# EAGLE design atsams70n-switch (EAGLE 8.3.2)
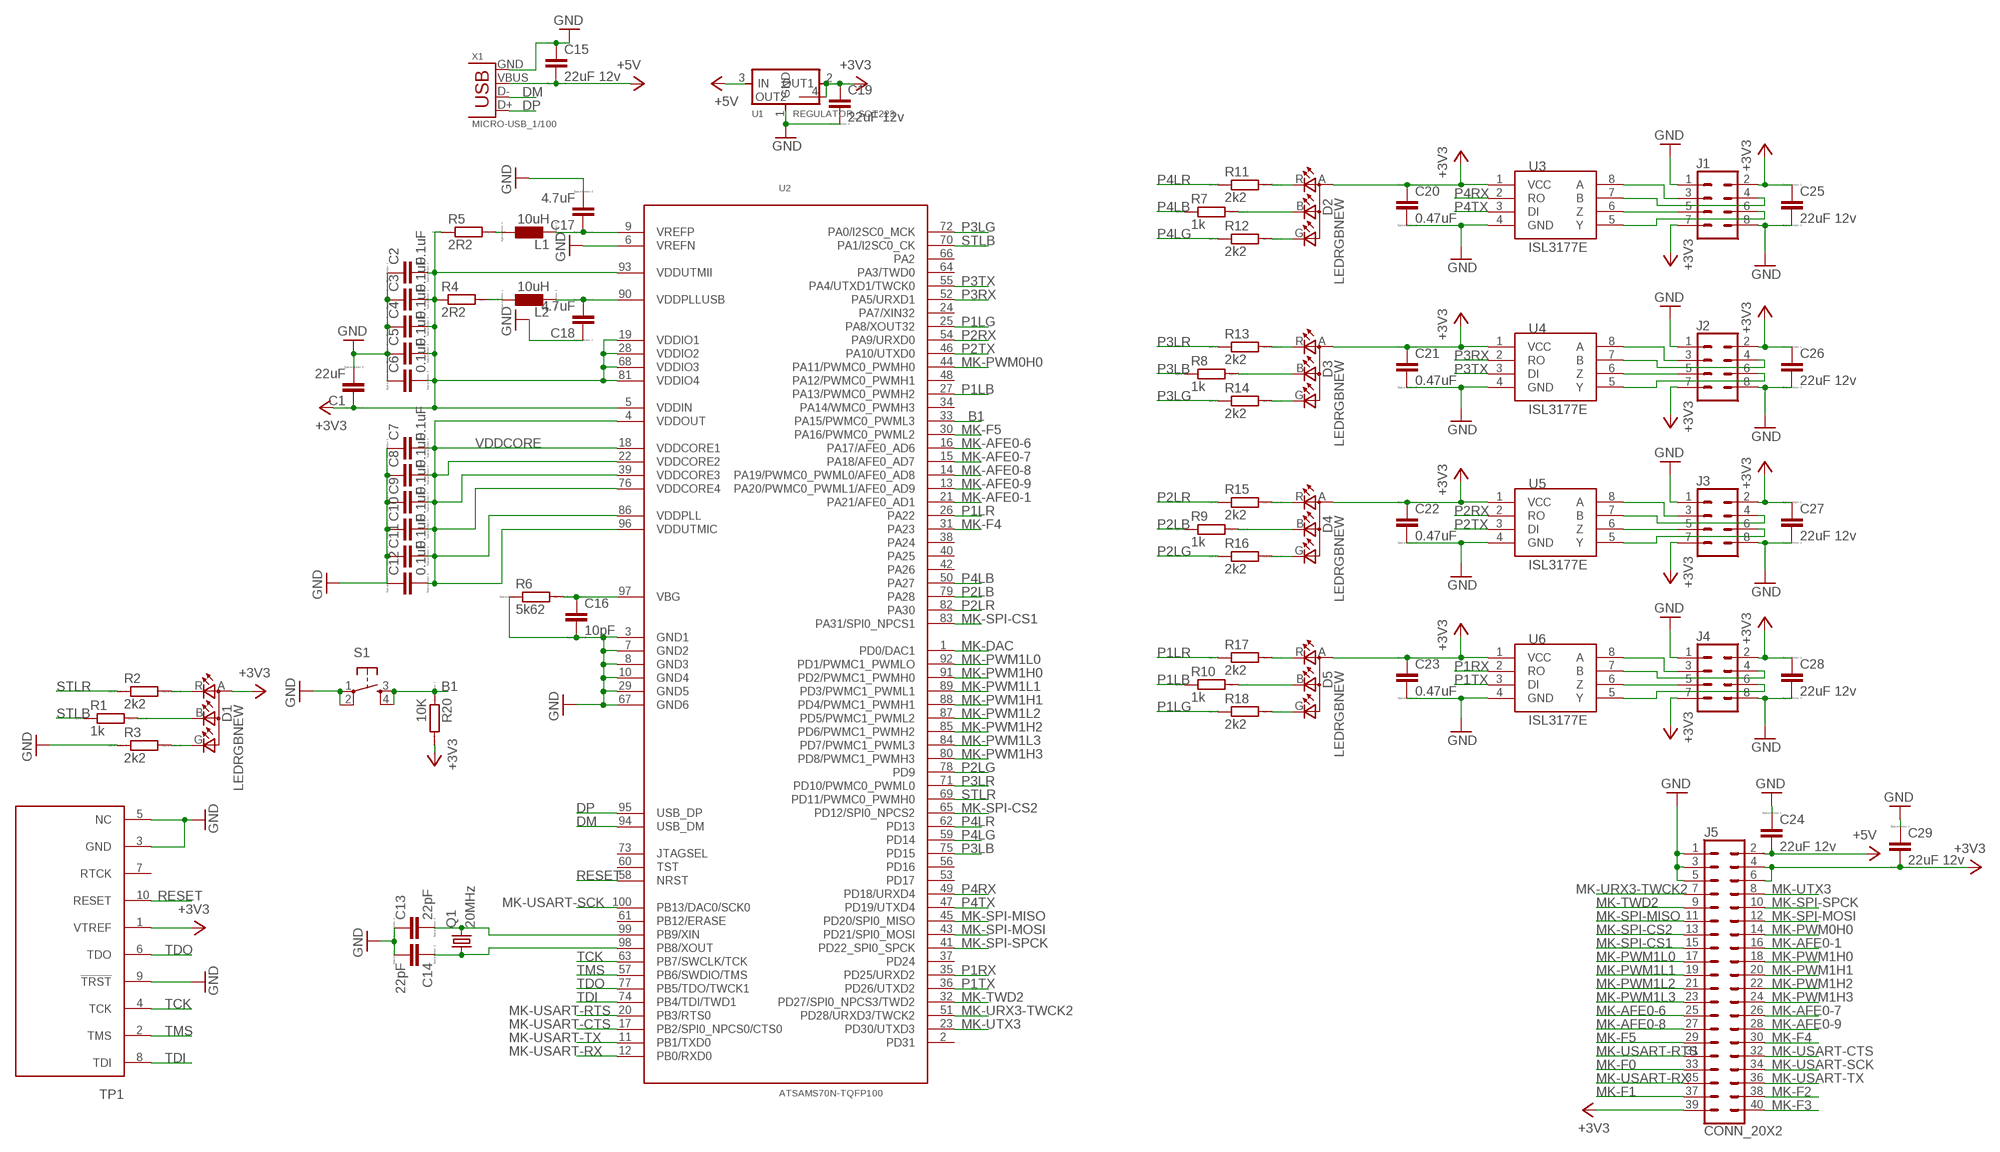
[diagram p0: schematic, sheet 1]

## Parts
C1  22uF  C  [C0805]
C2  0.1uF  CC0603  [C0603]
C3  0.1uF  CC0603  [C0603]
C4  0.1uF  CC0603  [C0603]
C5  0.1uF  CC0603  [C0603]
C6  0.1uF  CC0603  [C0603]
C7  0.1uF  CC0603  [C0603]
C8  0.1uF  CC0603  [C0603]
C9  0.1uF  CC0603  [C0603]
C10  0.1uF  CC0603  [C0603]
C11  0.1uF  CC0603  [C0603]
C12  0.1uF  CC0603  [C0603]
C13  22pF  CC0603  [C0603]
C14  22pF  CC0603  [C0603]
C15  22uF 12v  C  [C0805]
C16  10pF  C  [C0805]
C17  4.7uF  C  [C0805]
C18  4.7uF  C  [C0805]
C19  22uF 12v  C  [C0805]
C20  0.47uF  C  [C0805]
C21  0.47uF  C  [C0805]
C22  0.47uF  C  [C0805]
C23  0.47uF  C  [C0805]
C24  22uF 12v  C  [C0805]
C25  22uF 12v  C  [C0805]
C26  22uF 12v  C  [C0805]
C27  22uF 12v  C  [C0805]
C28  22uF 12v  C  [C0805]
C29  22uF 12v  C  [C0805]
D1  LEDRGBNEW  [P-LCC-4]
D2  LEDRGBNEW  [P-LCC-4]
D3  LEDRGBNEW  [P-LCC-4]
D4  LEDRGBNEW  [P-LCC-4]
D5  LEDRGBNEW  [P-LCC-4]
J1  CONN_04X2SHROUDED  [2X4-SHROUDED]
J2  CONN_04X2SHROUDED  [2X4-SHROUDED]
J3  CONN_04X2SHROUDED  [2X4-SHROUDED]
J4  CONN_04X2SHROUDED  [2X4-SHROUDED]
J5  CONN_20X2  [2X20]
L1  10uH  L  [L1812]
L2  10uH  L  [L1812]
Q1  20MHz  CRYSTALCTS406  [CTS406]
R1  1k  R  [R0805]
R2  2k2  R  [R0805]
R3  2k2  R  [R0805]
R4  2R2  R  [R0805]
R5  2R2  R  [R0805]
R6  5k62  R  [R0805]
R7  1k  R  [R0805]
R8  1k  R  [R0805]
R9  1k  R  [R0805]
R10  1k  R  [R0805]
R11  2k2  R  [R0805]
R12  2k2  R  [R0805]
R13  2k2  R  [R0805]
R14  2k2  R  [R0805]
R15  2k2  R  [R0805]
R16  2k2  R  [R0805]
R17  2k2  R  [R0805]
R18  2k2  R  [R0805]
R20  10K  R  [R0805]
S1  6MM_SWITCH6MM_SWITCH  [6MM_SWITCH]
TP1  TC2050-MCP-NL  [TC2030-MCP-NL]
U1  REGULATOR_SOT223  [SOT223]
U2  ATSAMS70N-TQFP100  [TQFP100-14X14]
U3  ISL3177E  [MSOP8]
U4  ISL3177E  [MSOP8]
U5  ISL3177E  [MSOP8]
U6  ISL3177E  [MSOP8]
X1  MICRO-USB_1/100  [DX4R005HJ5_100]

## Nets
+3V3: C1.1 C2.2 C3.2 C4.2 C5.2 C6.2 C19.1 C20.1 C21.1 C22.1 C23.1 C25.1 C26.1 C27.1 C28.1 C29.2 D1.A(A2) D2.A(A2) D3.A(A2) D4.A(A2) D5.A(A2) J1.2 J1.7 J2.2 J2.7 J3.2 J3.7 J4.2 J4.7 J5.4 J5.6 J5.39 R4.1 R5.1 R20.2 TP1.1(VTREF) U1.2(OUT1) U1.4(OUT2) U2.5(VDDIN) U2.19(VDDIO1) U2.28(VDDIO2) U2.68(VDDIO3) U2.81(VDDIO4) U2.93(VDDUTMII) U3.1(VCC) U4.1(VCC) U5.1(VCC) U6.1(VCC)
+5V: C15.2 C24.2 J5.2 U1.3(IN) X1.VBUS
B1: R20.1 S1.3(S) S1.4(S1) U2.33(PA15/PWMC0_PWML3)
DM: U2.94(USB_DM) X1.D-
DP: U2.95(USB_DP) X1.D+
GND: C1.2 C2.1 C3.1 C4.1 C5.1 C6.1 C7.1 C8.1 C9.1 C10.1 C11.1 C12.1 C13.1 C14.2 C15.1 C16.2 C17.2 C18.1 C19.2 C20.2 C21.2 C22.2 C23.2 C24.1 C25.2 C26.2 C27.2 C28.2 C29.1 J1.1 J1.8 J2.1 J2.8 J3.1 J3.8 J4.1 J4.8 J5.1 J5.3 J5.5 R3.1 R6.1 S1.1(P) S1.2(P1) TP1.3(GND) TP1.5(NC) TP1.9(!TRST) U1.1(GND) U2.3(GND1) U2.6(VREFN) U2.7(GND2) U2.8(GND3) U2.10(GND4) U2.29(GND5) U2.67(GND6) U3.4(GND) U4.4(GND) U5.4(GND) U6.4(GND) X1.GND
MK-AFE0-1: J5.16 U2.21(PA21/AFE0_AD1)
MK-AFE0-6: J5.25 U2.16(PA17/AFE0_AD6)
MK-AFE0-7: J5.26 U2.15(PA18/AFE0_AD7)
MK-AFE0-8: J5.27 U2.14(PA19/PWMC0_PWML0/AFE0_AD8)
MK-AFE0-9: J5.28 U2.13(PA20/PWMC0_PWML1/AFE0_AD9)
MK-DAC: U2.1(PD0/DAC1)
MK-F0: J5.33
MK-F1: J5.37
MK-F2: J5.38
MK-F3: J5.40
MK-F4: J5.30 U2.31(PA23)
MK-F5: J5.29 U2.30(PA16/PWMC0_PWML2)
MK-PWM0H0: J5.14 U2.44(PA11/PWMC0_PWMH0)
MK-PWM1H0: J5.18 U2.91(PD2/PWMC1_PWMH0)
MK-PWM1H1: J5.20 U2.88(PD4/PWMC1_PWMH1)
MK-PWM1H2: J5.22 U2.85(PD6/PWMC1_PWMH2)
MK-PWM1H3: J5.24 U2.80(PD8/PWMC1_PWMH3)
MK-PWM1L0: J5.17 U2.92(PD1/PWMC1_PWMLO)
MK-PWM1L1: J5.19 U2.89(PD3/PWMC1_PWML1)
MK-PWM1L2: J5.21 U2.87(PD5/PWMC1_PWML2)
MK-PWM1L3: J5.23 U2.84(PD7/PWMC1_PWML3)
MK-SPI-CS1: J5.15 U2.83(PA31/SPI0_NPCS1)
MK-SPI-CS2: J5.13 U2.65(PD12/SPI0_NPCS2)
MK-SPI-MISO: J5.11 U2.45(PD20/SPI0_MISO)
MK-SPI-MOSI: J5.12 U2.43(PD21/SPI0_MOSI)
MK-SPI-SPCK: J5.10 U2.41(PD22_SPI0_SPCK)
MK-TWD2: J5.9 U2.32(PD27/SPI0_NPCS3/TWD2)
MK-URX3-TWCK2: J5.7 U2.51(PD28/URXD3/TWCK2)
MK-USART-CTS: J5.32 U2.17(PB2/SPI0_NPCS0/CTS0)
MK-USART-RTS: J5.31 U2.20(PB3/RTS0)
MK-USART-RX: J5.35 U2.12(PB0/RXD0)
MK-USART-SCK: J5.34 U2.100(PB13/DAC0/SCK0)
MK-USART-TX: J5.36 U2.11(PB1/TXD0)
MK-UTX3: J5.8 U2.23(PD30/UTXD3)
N$1: D5.R(CRED) R17.2
N$2: D5.B(CBLUE) R10.2
N$3: D5.G(CGREEN) R18.2
N$4: C13.2 Q1.3 U2.99(PB9/XIN)
N$5: C14.1 Q1.1 U2.98(PB8/XOUT)
N$7: C16.1 R6.2 U2.97(VBG)
N$8: L2.1 R4.2
N$9: L1.1 R5.2
N$10: C18.2 L2.2 U2.90(VDDPLLUSB)
N$11: C17.1 L1.2 U2.9(VREFP)
N$12: D1.R(CRED) R2.2
N$13: J3.3 U5.8(A)
N$14: J3.4 U5.7(B)
N$15: J3.5 U5.6(Z)
N$16: J3.6 U5.5(Y)
N$17: D4.R(CRED) R15.2
N$18: D4.B(CBLUE) R9.2
N$19: D4.G(CGREEN) R16.2
N$20: J2.3 U4.8(A)
N$21: J2.4 U4.7(B)
N$22: J2.5 U4.6(Z)
N$23: J2.6 U4.5(Y)
N$24: D3.R(CRED) R13.2
N$25: J4.3 U6.8(A)
N$26: J4.4 U6.7(B)
N$27: J4.5 U6.6(Z)
N$28: J4.6 U6.5(Y)
N$29: D3.B(CBLUE) R8.2
N$30: D3.G(CGREEN) R14.2
N$31: J1.3 U3.8(A)
N$32: J1.4 U3.7(B)
N$33: J1.5 U3.6(Z)
N$34: J1.6 U3.5(Y)
N$35: D2.R(CRED) R11.2
N$36: D2.B(CBLUE) R7.2
N$37: D2.G(CGREEN) R12.2
N$38: D1.B(CBLUE) R1.2
N$39: D1.G(CGREEN) R3.2
P1LB: R10.1 U2.27(PA13/PWMC0_PWMH2)
P1LG: R18.1 U2.25(PA8/XOUT32)
P1LR: R17.1 U2.26(PA22)
P1RX: U2.35(PD25/URXD2) U6.2(RO)
P1TX: U2.36(PD26/UTXD2) U6.3(DI)
P2LB: R9.1 U2.79(PA28)
P2LG: R16.1 U2.78(PD9)
P2LR: R15.1 U2.82(PA30)
P2RX: U2.54(PA9/URXD0) U5.2(RO)
P2TX: U2.46(PA10/UTXD0) U5.3(DI)
P3LB: R8.1 U2.75(PD15)
P3LG: R14.1 U2.72(PA0/I2SC0_MCK)
P3LR: R13.1 U2.71(PD10/PWMC0_PWML0)
P3RX: U2.52(PA5/URXD1) U4.2(RO)
P3TX: U2.55(PA4/UTXD1/TWCK0) U4.3(DI)
P4LB: R7.1 U2.50(PA27)
P4LG: R12.1 U2.59(PD14)
P4LR: R11.1 U2.62(PD13)
P4RX: U2.49(PD18/URXD4) U3.2(RO)
P4TX: U2.47(PD19/UTXD4) U3.3(DI)
RESET: TP1.10(RESET) U2.58(NRST)
STLB: R1.1 U2.70(PA1/I2SC0_CK)
STLR: R2.1 U2.69(PD11/PWMC0_PWMH0)
TCK: TP1.4(TCK) U2.63(PB7/SWCLK/TCK)
TDI: TP1.8(TDI) U2.74(PB4/TDI/TWD1)
TDO: TP1.6(TDO) U2.77(PB5/TDO/TWCK1)
TMS: TP1.2(TMS) U2.57(PB6/SWDIO/TMS)
VDDCORE: C7.2 C8.2 C9.2 C10.2 C11.2 C12.2 U2.4(VDDOUT) U2.18(VDDCORE1) U2.22(VDDCORE2) U2.39(VDDCORE3) U2.76(VDDCORE4) U2.86(VDDPLL) U2.96(VDDUTMIC)
Unconnected: TP1.7(RTCK) U2.2(PD31) U2.24(PA7/XIN32) U2.34(PA14/WMC0_PWMH3) U2.37(PD24) U2.38(PA24) U2.40(PA25) U2.42(PA26) U2.48(PA12/PWMC0_PWMH1) U2.53(PD17) U2.56(PD16) U2.60(TST) U2.61(PB12/ERASE) U2.64(PA3/TWD0) U2.66(PA2) U2.73(JTAGSEL)

## Library data of the parts
C1-C29 = eagle-ltspice:C: CAPACITOR, European symbol; SPICEMODEL: NONE; SPICEPREFIX: C
D1-D5 = fab:LEDRGBNEW
J1-J4 = fab:CONN_04X2: Multi connection point. Often used as Generic Header-pin footprint for 0.1 inch spaced/style header connections On any of the 0.1 inch spaced packages, you can populate with these: Break Away Headers - Straight <https://www.sparkfun.com/products/116> (PRT-00116) Break Away Male Headers - Right Angle <https://www.sparkfun.com/products/553> (PRT-00553) Female Headers <https://www.sparkfun.com/products/115> (PRT-00115) Break Away Headers - Machine Pin <https://www.sparkfun.com/products/117> (PRT-00117) Break Away Female Headers - Swiss Machine Pin <https://www.sparkfun.com/products/743> (PRT-00743)
J5 = SparkFun-Connectors:CONN_20X2: Multi connection point. Often used as Generic Header-pin footprint for 0.1 inch spaced/style header connections On any of the 0.1 inch spaced packages, you can populate with these: Break Away Headers - Straight <https://www.sparkfun.com/products/116> (PRT-00116) Break Away Male Headers - Right Angle <https://www.sparkfun.com/products/553> (PRT-00553) Female Headers <https://www.sparkfun.com/products/115> (PRT-00115) Break Away Headers - Machine Pin <https://www.sparkfun.com/products/117> (PRT-00117) Break Away Female Headers - Swiss Machine Pin <https://www.sparkfun.com/products/743> (PRT-00743)
L1 L2 = eagle-ltspice:L: INDUCTOR, European symbol; SPICEMODEL: NONE; SPICEPREFIX: L
Q1 = crystal:CRYSTAL: CRYSTAL; OC_FARNELL: unknown; OC_NEWARK: unknown
R1-R18 R20 = eagle-ltspice:R: RESISTOR, European symbol; SPICEMODEL: NONE; SPICEPREFIX: R
S1 = fab:6MM_SWITCH: OMRON SWITCH
TP1 = tag-connect-2050:TC2050: TAG-CONNECT ISP Connector Manufacturer: Tag-Connect <www.tag-connect.com> Cable for easy In-Circuit PCB Programming. Designed for JTAG 10 pin, suitable for many others. Pin Connection for TC2050 NL. PAD Description 1 VTREF 2 TMS 3 GND 4 TCK 5 NC 6 TDO 7 RTCK 8 TDI 9 !TRST 10 RESET ©2009 ROFA.cz Modified 7/2011 by Tim McCarthy-Smith VIDA Products INC
U1 = fab:REGULATOR_SOT223
U2 = fab:ATSAMS70N-TQFP100
U3-U6 = fab:ISL3177E
X1 = fab:MICRO-USB: SMD micro USB connector as found in the fablab inventory. Three footprint variants included: original, as described by manufacturer's datasheet for milling with the 1/100" bit for milling with the 1/64" bit Made by Zaerc.

## Board
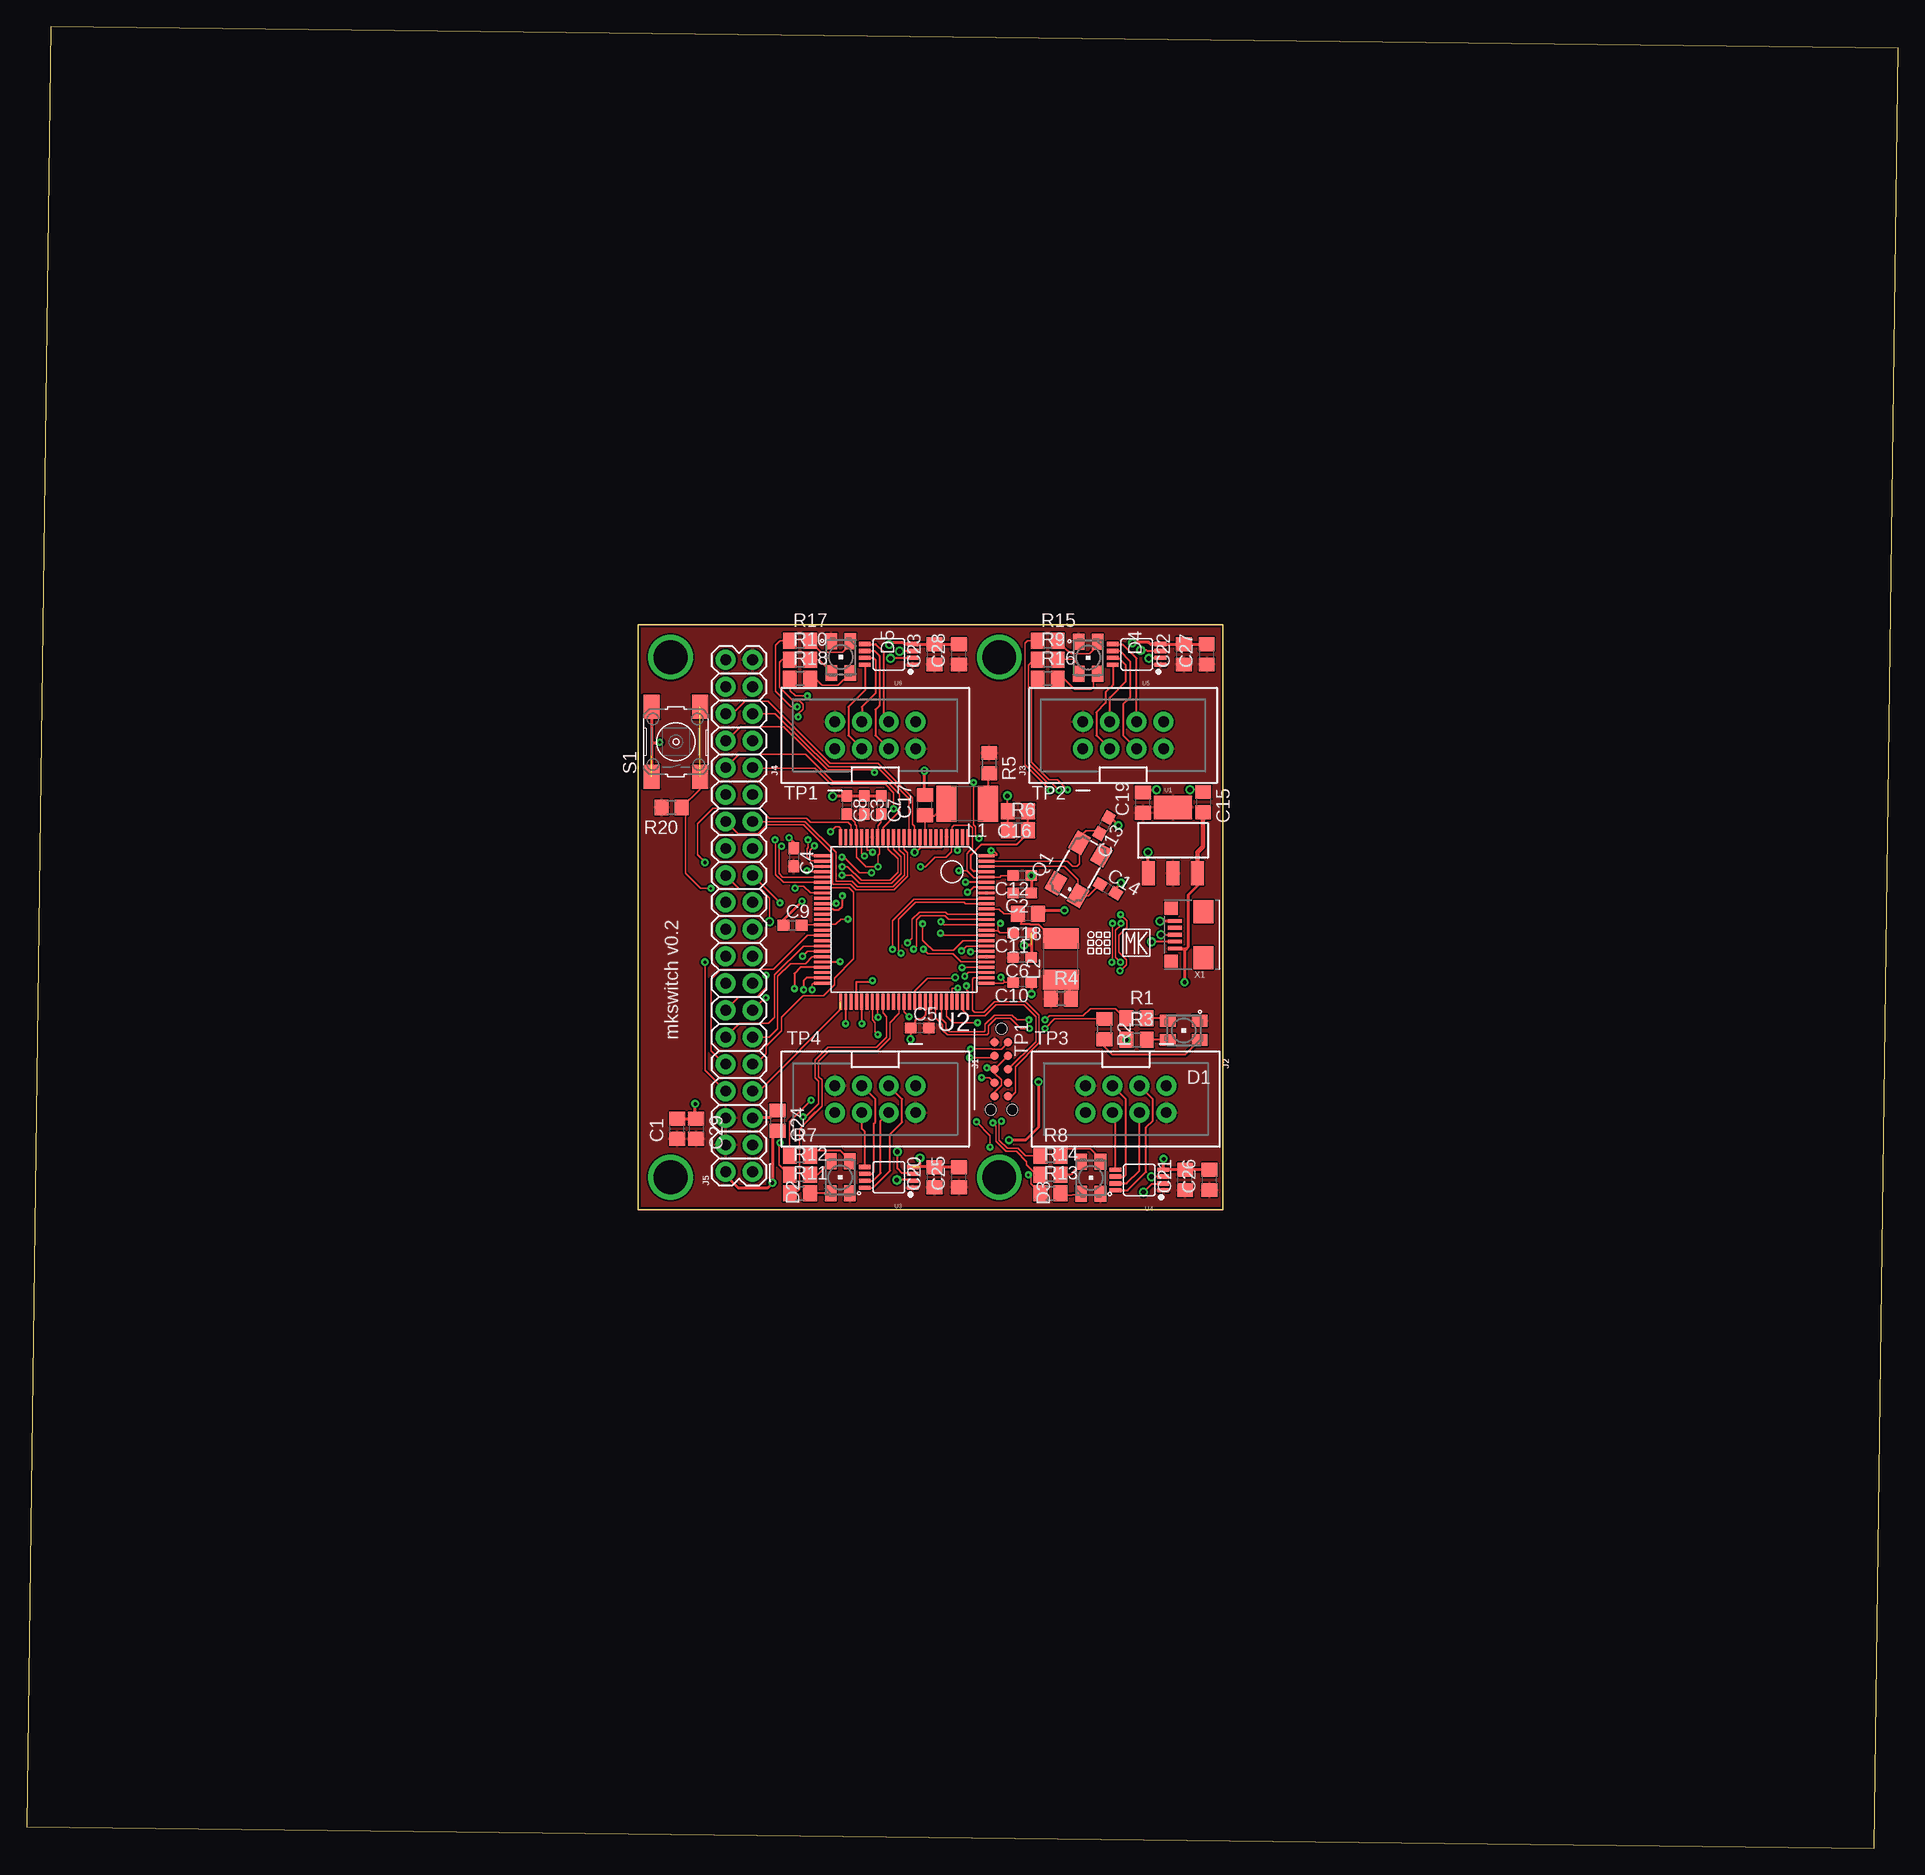
[diagram p1: board, top side]
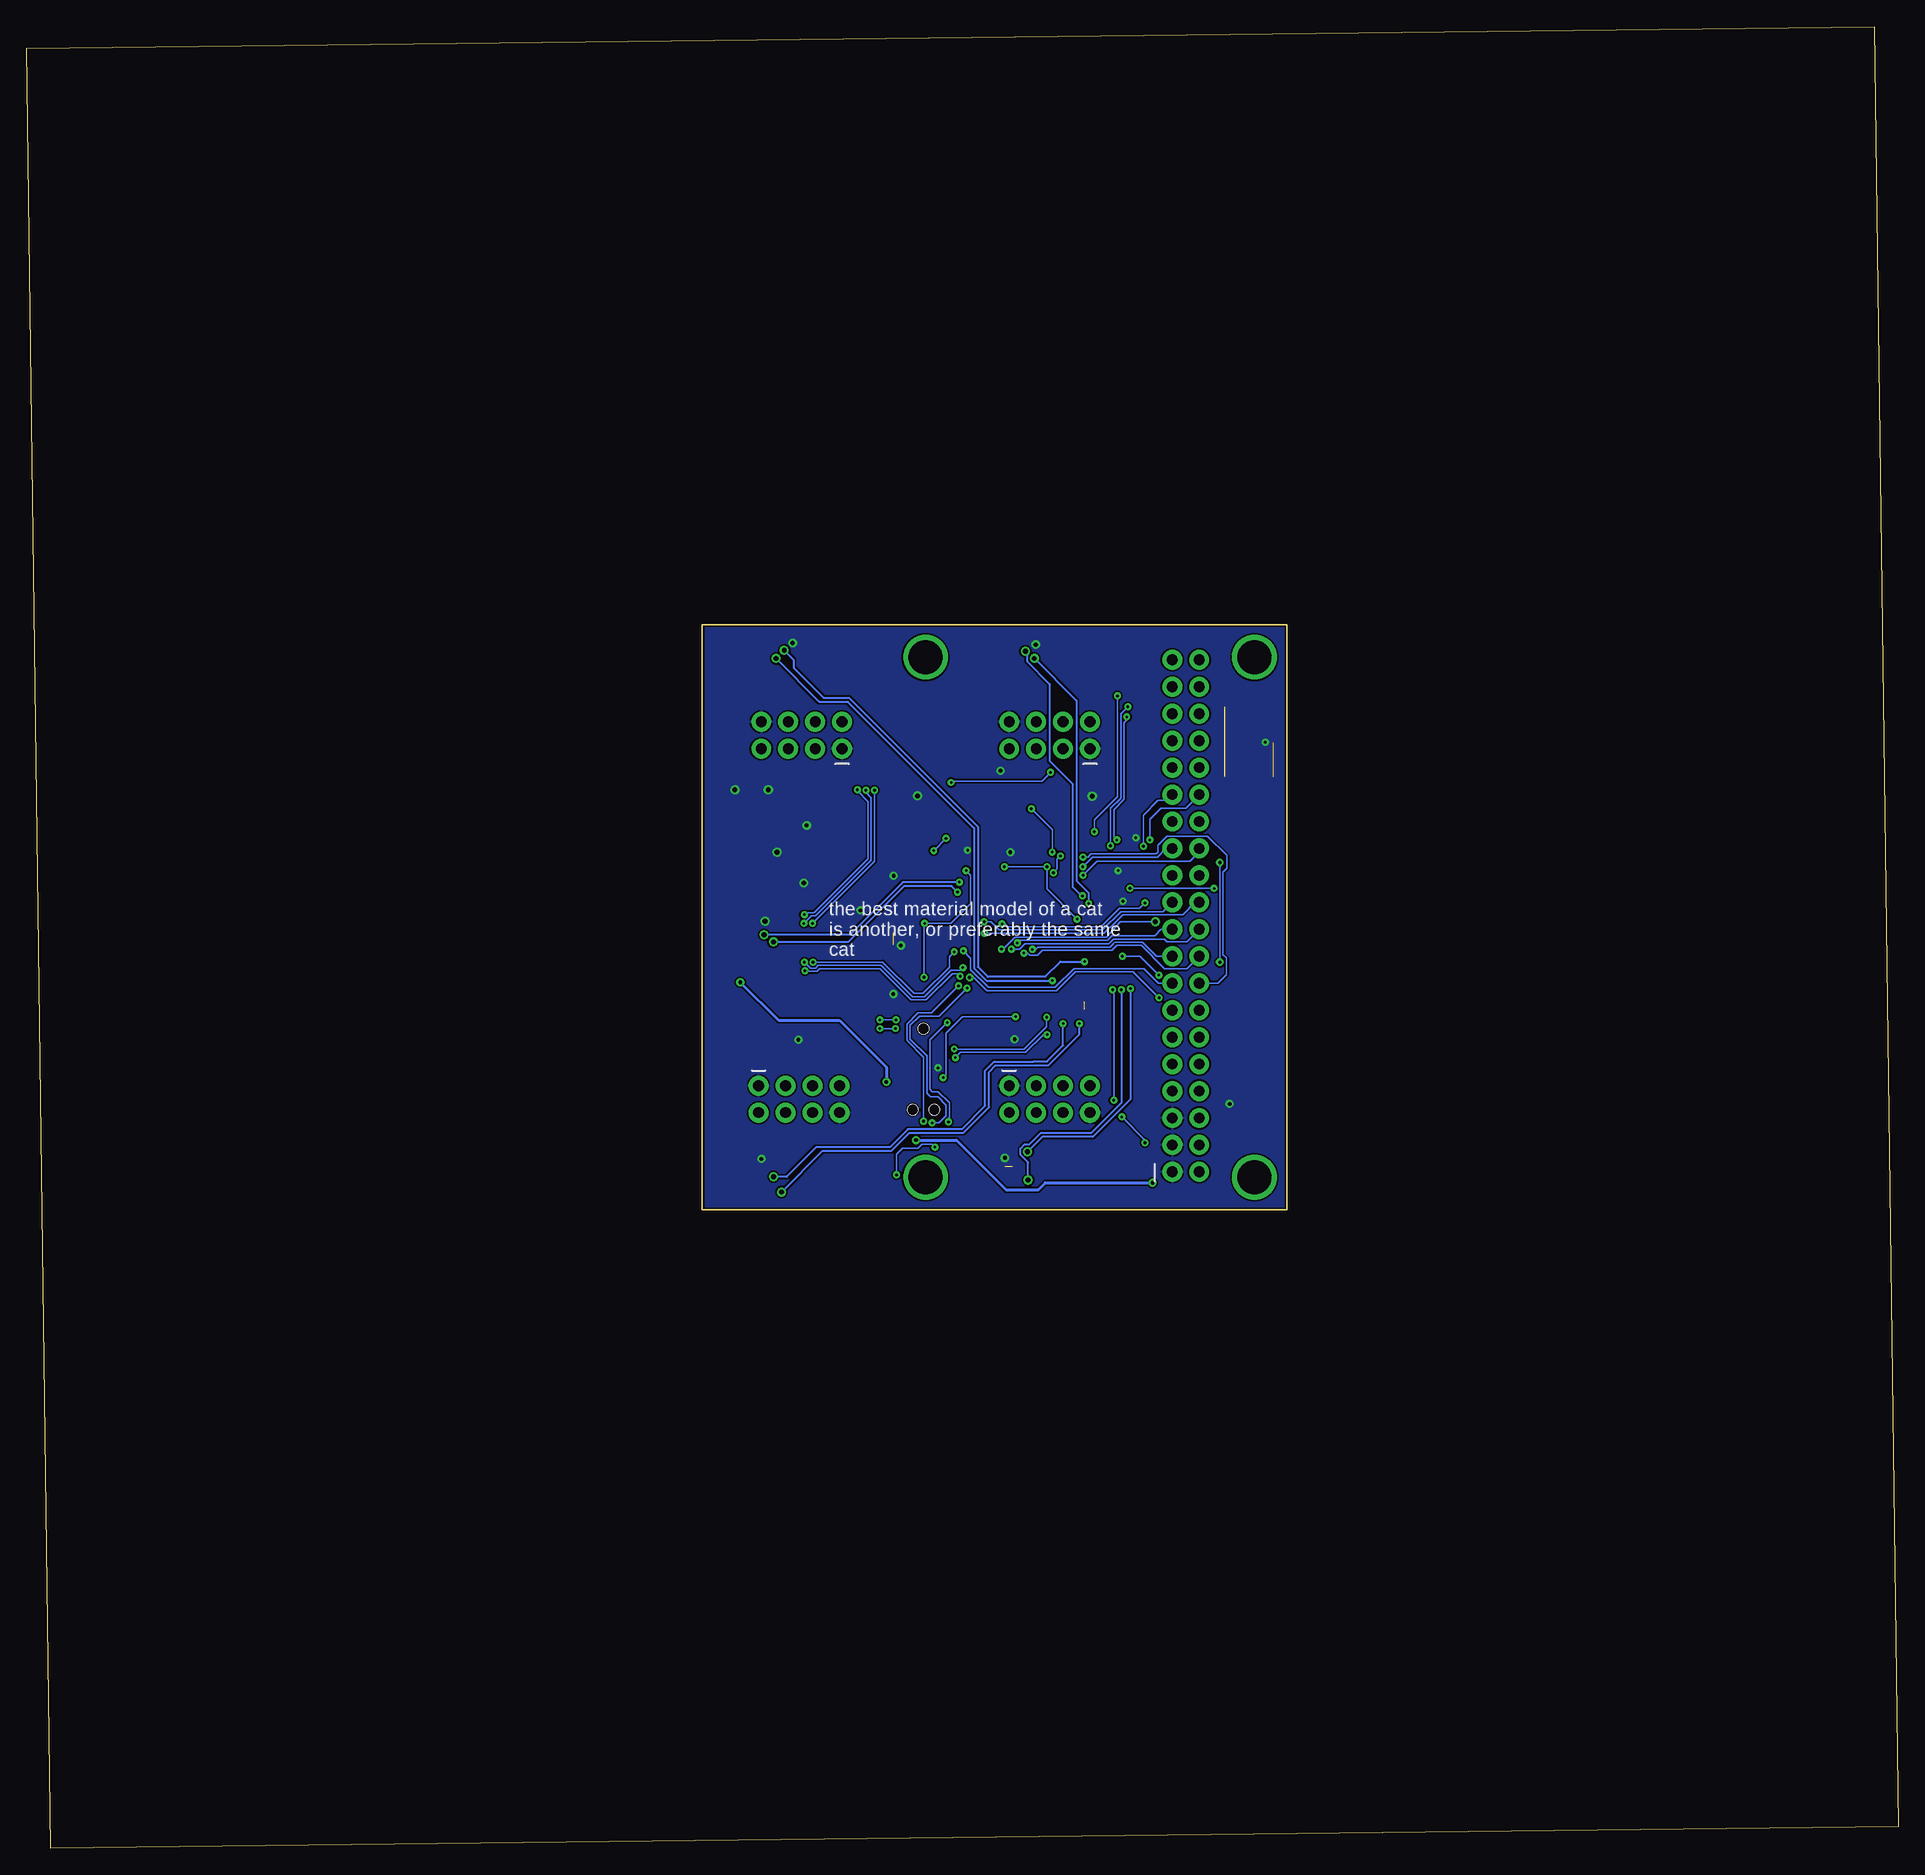
[diagram p2: board, bottom side, seen from below]

Size 176.45 x 171.69 mm. Coordinates in mm from the lower left corner, seen from the top.
Outline: 0,2.03 174.17,0 176.45,169.66 2.29,171.69 0,2.03
Outline: 57.66,115.32 57.66,60.2 112.78,60.2 112.78,115.32 57.66,115.32
Copper layers (1*16): Top 0.035mm / dielectric 1.5mm / Bottom 0.035mm
Design rules "default *": minimum track width 6mil, minimum drill 0.35mm, track to track 6mil, track to pad 6mil, pad to pad 6mil, via to via 6mil, smd to smd 6mil, copper to edge 6mil, drill to drill 6mil, minimum pad ring 10mil, minimum via ring 8mil, stop-mask expansion 4mil, vias tented up to drill 0mil, thermal gap 6mil
Milling: 4 lines

### Footprints (pad centres in the part's own frame; a part is rotated, then mirrored left to right if it is on the bottom)
C0805 = smd 1.3 x 1.5: 1 -0.95,0; 2 0.95,0
C0603 = smd 1.1 x 1: 1 -0.85,0; 2 0.85,0
P-LCC-4 = smd 1.1 x 1.5: A 0.902,-1.5; B 0.902,1.5; G -0.902,1.5; R -0.902,-1.5
2X4-SHROUDED = drill 1.016 pad 1.88: 1 -1.27,2.54; 2 1.27,2.54; 3 -1.27,0; 4 1.27,0; 5 -1.27,-2.54; 6 1.27,-2.54; 7 -1.27,-5.08; 8 1.27,-5.08
2X20 = drill 1.016 pad 1.88: 1 0,0; 2 0,2.54; 3 2.54,0; 4 2.54,2.54; 5 5.08,0; 6 5.08,2.54; 7 7.62,0; 8 7.62,2.54; 9 10.16,0; 10 10.16,2.54; 11 12.7,0; 12 12.7,2.54; 13 15.24,0; 14 15.24,2.54; 15 17.78,0; 16 17.78,2.54; 17 20.32,0; 18 20.32,2.54; 19 22.86,0; 20 22.86,2.54; 21 25.4,0; 22 25.4,2.54; 23 27.94,0; 24 27.94,2.54; 25 30.48,0; 26 30.48,2.54; 27 33.02,0; 28 33.02,2.54; 29 35.56,0; 30 35.56,2.54; 31 38.1,0; 32 38.1,2.54; 33 40.64,0; 34 40.64,2.54; 35 43.18,0; 36 43.18,2.54; 37 45.72,0; 38 45.72,2.54; 39 48.26,0; 40 48.26,2.54
L1812 = smd 1.9 x 3.4: 1 -1.95,0; 2 1.95,0
CTS406 = smd 1.9 x 1.4: 1 -2.2,-1.2; 2 2.2,-1.2; 3 2.2,1.2; 4 -2.2,1.2
R0805 = smd 1.3 x 1.5: 1 -0.95,0; 2 0.95,0
6MM_SWITCH = smd 2.286 x 1.524: 1 -3.302,2.286; 2 3.302,2.286; 3 -3.302,-2.286; 4 3.302,-2.286
TC2030-MCP-NL = smd 0.787 x 0.787: 1 1.27,-0.635; 2 2.54,-0.635; 3 3.81,-0.635; 4 5.08,-0.635; 5 6.35,-0.635; 6 6.35,0.635; 7 5.08,0.635; 8 3.81,0.635; 9 2.54,0.635; 10 1.27,0.635 | hole 1: 0,0; 7.62,-1.016; 7.62,1.016
SOT223 = smd 1.219 x 2.235: 1 -2.311,-3.099; 2 0,-3.099; 3 2.311,-3.099 | smd 3.6 x 2.2: 4 0,3.099
TQFP100-14X14 = smd 0.27 x 1.5: 1 -6,-7.75; 2 -5.5,-7.75; 3 -5,-7.75; 4 -4.5,-7.75; 5 -4,-7.75; 6 -3.5,-7.75; 7 -3,-7.75; 8 -2.5,-7.75; 9 -2,-7.75; 10 -1.5,-7.75; 11 -1,-7.75; 12 -0.5,-7.75; 13 0,-7.75; 14 0.5,-7.75; 15 1,-7.75; 16 1.5,-7.75; 17 2,-7.75; 18 2.5,-7.75; 19 3,-7.75; 20 3.5,-7.75; 21 4,-7.75; 22 4.5,-7.75; 23 5,-7.75; 24 5.5,-7.75; 25 6,-7.75; 51 6,7.75; 52 5.5,7.75; 53 5,7.75; 54 4.5,7.75; 55 4,7.75; 56 3.5,7.75; 57 3,7.75; 58 2.5,7.75; 59 2,7.75; 60 1.5,7.75; 61 1,7.75; 62 0.5,7.75; 63 0,7.75; 64 -0.5,7.75; 65 -1,7.75; 66 -1.5,7.75; 67 -2,7.75; 68 -2.5,7.75; 69 -3,7.75; 70 -3.5,7.75; 71 -4,7.75; 72 -4.5,7.75; 73 -5,7.75; 74 -5.5,7.75; 75 -6,7.75 | smd 1.5 x 0.27: 26 7.75,-6; 27 7.75,-5.5; 28 7.75,-5; 29 7.75,-4.5; 30 7.75,-4; 31 7.75,-3.5; 32 7.75,-3; 33 7.75,-2.5; 34 7.75,-2; 35 7.75,-1.5; 36 7.75,-1; 37 7.75,-0.5; 38 7.75,0; 39 7.75,0.5; 40 7.75,1; 41 7.75,1.5; 42 7.75,2; 43 7.75,2.5; 44 7.75,3; 45 7.75,3.5; 46 7.75,4; 47 7.75,4.5; 48 7.75,5; 49 7.75,5.5; 50 7.75,6; 76 -7.75,6; 77 -7.75,5.5; 78 -7.75,5; 79 -7.75,4.5; 80 -7.75,4; 81 -7.75,3.5; 82 -7.75,3; 83 -7.75,2.5; 84 -7.75,2; 85 -7.75,1.5; 86 -7.75,1; 87 -7.75,0.5; 88 -7.75,0; 89 -7.75,-0.5; 90 -7.75,-1; 91 -7.75,-1.5; 92 -7.75,-2; 93 -7.75,-2.5; 94 -7.75,-3; 95 -7.75,-3.5; 96 -7.75,-4; 97 -7.75,-4.5; 98 -7.75,-5; 99 -7.75,-5.5; 100 -7.75,-6
MSOP8 = smd 0.4 x 1.1: 1 -0.975,-2.25; 2 -0.325,-2.25; 3 0.325,-2.25; 4 0.975,-2.25; 5 0.975,2.25; 6 0.325,2.25; 7 -0.325,2.25; 8 -0.975,2.25
DX4R005HJ5_100 = smd 0.35 x 1.35: D+ 0,1.6; D- -0.65,1.6; GND 1.3,1.6; ID 0.65,1.6; VBUS -1.3,1.6 | smd 1.2 x 1.3: GND@1 -2.5,1.95; GND@2 2.5,1.95 | smd 2.15 x 1.9: GND@3 -2.175,-1.1; GND@4 2.175,-1.1

### Placement (x,y rotation side)
C1  61.34,67.82 90 top
C2  93.86,90.05 180 top
C3  78.96,98.32 270 top
C4  72.32,93.4 270 top
C5  84.2,77.32 0 top
C6  93.86,83.95 180 top
C7  80.57,98.32 270 top
C8  77.34,98.32 270 top
C9  72.2,87 0 top
C10  93.86,81.61 180 top
C11  93.86,86.28 180 top
C12  93.86,91.67 180 top
C13  101.58,96.4 240 top
C14  101.94,90.44 330 top
C15  110.92,98.6 270 top
C16  93.47,97.75 180 top
C17  84.7,98.32 90 top
C18  94.4,88.08 180 top
C19  105.23,98.55 90 top
C20  85.6,63.25 90 top
C21  109.22,62.99 90 top
C22  109.09,112.52 90 top
C23  85.6,112.52 90 top
C24  70.79,68.58 270 top
C25  87.88,63.25 90 top
C26  111.51,62.99 90 top
C27  111.25,112.52 90 top
C28  87.88,112.52 90 top
C29  63.12,67.82 270 top
D1  109.09,77.09 90 top
D2  76.71,63.25 0 top
D3  100.33,63.2 0 top
D4  100.08,112.22 180 top
D5  76.76,112.27 180 top
J1  81.28,70.61 270 top
J2  104.9,70.61 270 top
J3  102.11,104.9 90 top
J4  78.74,104.9 90 top
J5  68.45,63.75 90 top
L1  88.68,98.46 180 top
L2  97.5,83.81 90 top
Q1  99.19,92.27 60 top
R1  104.65,78.23 0 top
R2  101.6,77.22 270 top
R3  104.65,76.2 0 top
R4  97.51,80.08 0 top
R5  90.75,102.27 270 top
R6  93.47,95.96 0 top
R7  72.9,65.28 0 top
R8  96.52,65.28 0 top
R9  96.27,112.01 0 top
R10  72.9,112.01 0 top
R11  72.9,61.72 0 top
R12  72.9,63.5 0 top
R13  96.52,61.72 0 top
R14  96.52,63.5 0 top
R15  96.27,113.79 0 top
R16  96.27,110.24 0 top
R17  72.9,113.79 0 top
R18  72.9,110.24 0 top
R20  60.81,98.09 180 top
S1  61.21,104.29 90 top
TP1  91.9,77.24 270 top
U1  108.08,95 0 top
U2  82.73,87.54 180 top
U3  81.28,63.25 90 top
U4  104.9,62.99 90 top
U5  104.65,112.52 90 top
U6  81.28,112.52 90 top
U$1  [MK-LOGO-SILK]  104.65,85.34 0 top
U$2  [CBA-SILK-LOGO]  101.09,85.34 0 top
X1  109.85,86.11 90 top

### Tracks (layer width: path | path; a pad name or v marks a point on that pad's centre or on a via)
+3V3
  pour Top: 57.66,115.32 112.78,115.32 112.78,60.2 57.66,60.2
+5V  (via drill 0.35)
  Top 0.305: X1.VBUS 108.28,84.78 109.32,84.78 | 109.32,84.78 109.53,84.99 109.53,89.87 110.39,90.73 U1.3 | 109.32,84.78 109.17,84.63 v109.17,81.64 | v95.4,72.24 95.4,67.97 94.18,66.75 v92.61,66.75 | 65.91,63.68 J5.2 65.91,63.42 67.11,62.23 69.85,62.23 v70.31,62.74 70.31,67.45 C24.2
  Top 0.406: C15.2 110.9,97.63 110.9,94.39 110.39,93.88 U1.3
  Bottom 0.305: v109.17,81.64 105.56,78.03 99.82,78.03 95.4,73.61 v95.4,72.24 | v92.61,66.75 88.8,66.75 84.12,62.08 81.08,62.08 80.42,62.74 v70.31,62.74
B1  (via drill 0.25)  (1 unrouted)
  Top 0.152: S1.3 63.5,99.84 R20.1 62.13,97.72 62.13,91.9 63.55,90.47 v64.51,90.47 | U2.33 73.89,90.04 73.25,90.68 72.63,90.68 v72.44,90.48
  Bottom 0.152: v72.44,90.48 v64.52,90.48 v64.51,90.47
DM  (via drill 0.25, 0.45)
  Top 0.203: X1.D- 108.22,85.42 v106.05,85.42 | U2.94 90.44,90.58 89.26,90.58 88.8,90.12 v88.7,90.12
  Bottom 0.203: v106.05,85.42 98.98,85.42 97.29,87.12 97.28,87.12 97.28,87.13 93.73,90.68 89.26,90.68 v88.7,90.12
DP  (via drill 0.25, 0.45)
  Top 0.203: 90.46,91.06 U2.95 88.54,91.04 v88.52,91.06 | v106.93,86.11 X1.D+
  Bottom 0.203: v88.52,91.06 93.85,91.06 98.81,86.11 v106.93,86.11
GND  (via drill 0.25, 0.35, 0.4, 0.45)  (3 unrouted)
  Top 0.152: TP1.9 TP1.3 | TP1.3 91.27,73.04 91.89,72.41 91.89,71.9 91.27,71.28 TP1.5 | U2.8 85.24,95.28 85.24,94.28 | 85.24,94.28 84.28,94.28 | 84.28,94.28 84.23,94.34 U2.10 | 84.28,94.28 83.87,93.88 v83.72,93.88 | U2.3 87.74,95.27 v87.74,94.07 | 85.75,94.28 85.24,94.28 | 85.75,94.28 85.73,94.31 U2.7 | U2.6 86.26,95.26 86.26,94.28 85.75,94.28 | TP1.3 90.66,73.43 v90.53,73.56 | U2.29 73.67,92.04 v73.56,92.15
  Top 0.203: R6.1 C16.2 92.46,97.81 v92.46,99.19 | C19.2 105.51,99.78 v106.53,99.78 | C15.1 110.7,99.78 v109.68,99.78 | U2.67 84.73,79.78 84.73,78.54 84.33,78.13 83.87,78.13 83.87,78.12 83.77,78.02 83.77,77.88 83.35,77.46 C5.1 83.31,77.28 v83.31,76.25
  Top 0.305: 83.56,113.47 U6.4 82.74,113.5 82.6,113.64 81.53,113.64 v81.33,113.44 | 83.56,113.47 C23.2 C28.2 | 83.56,113.47 83.57,113.48 | U1.1 105.72,91.95 v105.72,93.88 | X1.GND 108.22,87.38 v106.83,87.38 | C7.1 C3.1 C8.1 v76,99.16 | C17.2 84.63,99.34 v84.63,101.55 | C12.1 C2.1 | C18.1 95.66,88.39 v97.84,88.39 | C10.1 94.74,81.58 v94.74,80.52 | C11.1 C6.1 | 94.71,85.14 94.66,85.09 v94.03,85.09 | U5.4 106.92,113.47 | 106.92,113.47 C22.2 C27.2 | C25.2 C20.2 85.57,64.22 U3.4 | C26.2 C21.2 109.19,63.97 U4.4 107.19,64 v107.19,64.97 | C24.1 70.09,68.83 J5.5 | C1.2 C29.1 63.04,68.84 v63.04,70.16 | 102.05,97.14 C13.1 102.2,97.14 v102.92,96.42 | C14.2 102.68,90.48 v103.17,90.98 | 106.92,113.47 105.98,113.47 105.77,113.69 104.34,113.69 v104.24,113.59 | 84.23,64.22 v84.23,65.08 | C9.1 71.35,87.51 v73.1,89.26 | C4.1 72.32,94.81 v71.88,95.25 | S1.2 S1.1 | 58.93,104.19 59.64,104.19 v59.69,104.24
  other vias: 103.7,76.2 94.71,91.67
  pour Bottom: 57.66,115.32 112.78,115.32 112.78,60.2 57.66,60.2
MK-AFE0-1  (via drill 0.25)
  Top 0.152: U2.21 78.73,93.79 v78.99,93.52 | v79.65,91.95 78.53,91.95 77.06,93.42 v76.86,93.42
  Bottom 0.152: v78.99,93.52 79.3,93.22 79.3,92.31 v79.65,91.95 | v76.86,93.42 76.41,93.42 76.11,93.73 69.98,93.73 69.81,93.89 69.81,94.53 68.94,95.4 65.13,95.4 63.3,93.57 63.3,92.35 63.65,92 63.65,84.23 63.35,83.92 63.35,82.35 64.16,81.53 J5.16
MK-AFE0-6  (via drill 0.25)
  Top 0.152: U2.16 81.23,94.18 82.14,93.27 82.14,91.97 81.41,91.24 78.69,91.24 77.41,92.52 v76.89,92.52
  Bottom 0.152: v76.89,92.52 75.98,93.42 69.85,93.42 69.04,94.23 J5.25
MK-AFE0-7  (via drill 0.25)
  Top 0.152: U2.15 81.74,95.28 81.74,94.18 82.45,93.47 82.45,91.84 81.53,90.93 78.54,90.93 77.76,91.71 v76.86,91.71
  Bottom 0.152: v76.86,91.71 75.55,93.02 66.8,93.02 65.91,93.9 J5.26
MK-AFE0-8
  Top 0.152: U2.14 82.25,95.27 82.25,94.13 82.75,93.62 82.75,91.72 81.66,90.63 78.33,90.63 77.81,91.15 77.56,91.15 | 77.56,91.15 | 77.56,91.15 76.3,91.15 76.3,93.6 | 76.3,93.6 | 73.13,96.77 | 73.13,96.77 J5.27 | 76.3,93.6 76.3,93.86 73.38,96.77 73.13,96.77
MK-AFE0-9
  Top 0.152: J5.28 67.08,95.61 68.94,95.61 69.8,96.47 73.26,96.47 75.96,93.77 76,93.73 76,90.84 77.68,90.84 78.21,90.32 81.79,90.32 83.06,91.59 83.06,93.83 82.73,94.16 U2.13
MK-F4  (via drill 0.25)
  Top 0.152: U2.31 71.34,91.04 70.61,91.77 70.61,95 v70.56,95.05
  Bottom 0.152: v70.56,95.05 70.56,96.98 69.49,98.04 67.18,98.04 J5.30
MK-F5  (via drill 0.25)
  Top 0.152: U2.30 71.27,91.54 70.92,91.9 70.92,94.18 v71.17,94.44
  Bottom 0.152: v71.17,94.44 71.17,97.38 69.8,98.75 69.01,98.75 J5.29
MK-PWM0H0  (via drill 0.25)
  Top 0.152: U2.44 73.62,84.54 v73.15,84.07 | v69.72,82.3 69.72,81.12 69.04,80.43 69.04,80.42 68.88,80.26 67.18,80.26 J5.14
  Bottom 0.152: v73.15,84.07 71.5,84.07 v69.72,82.3
MK-PWM1H0  (via drill 0.25)
  Top 0.152: U2.91 88.51,89.04 88.39,89.15 83.79,89.15 82.18,87.54 82.18,84.96 82.19,84.94 82.19,84.61 v82.44,84.37
  Bottom 0.152: v82.44,84.37 82.07,84.37 81.87,84.16 81.15,84.16 80.67,84.63 74.44,84.63 | J5.18 67.08,82.91 69.19,82.91 71.37,85.09 73.66,85.09 74.12,84.63 74.19,84.63 | 74.44,84.63 | 74.44,84.63 74.19,84.63 | 74.19,84.63
MK-PWM1H1  (via drill 0.25)
  Top 0.152: U2.88 86.91,87.54 86.57,87.88 84.26,87.88 83.87,87.5 83.87,85.01 v83.62,84.76
  Bottom 0.152: 82.49,85.1 | 82.49,85.1 82.32,85.27 74.78,85.27 74.66,85.27 74.42,85.27 74.41,85.28 74.4,85.28 74.39,85.28 | v83.62,84.76 82.83,84.76 82.49,85.1 | 74.39,85.28 | 74.39,85.28 | 74.39,85.28 74.32,85.37 74.23,85.46 74.14,85.55 74.06,85.63 74,85.7 69.19,85.7 68.94,85.45 67.08,85.45 J5.20
MK-PWM1H2  (via drill 0.25)
  Top 0.152: U2.85 86.36,86.06 v86.16,86.26
  Bottom 0.152: J5.22 66.29,89.15 67.46,87.99 73.1,87.99 74.27,86.82 74.35,86.82 74.91,86.26 v86.16,86.26
MK-PWM1H3  (via drill 0.25, 0.45)
  Top 0.152: U2.80 90.45,83.57 88.09,83.57 87.32,84.33 84.96,84.33 v84.54,84.75 | 70.21,87.48 v70.05,87.33 70.05,89.56 69.19,90.42 67.18,90.42 J5.24 65.91,91.82
  Bottom 0.152: v70.05,87.33 73.33,87.33 74.67,85.89 83.28,85.89 83.85,85.31 | 83.85,85.31 | v84.54,84.75 84.42,84.75 83.85,85.31
MK-PWM1L0  (via drill 0.25)
  Top 0.152: U2.92 90.4,89.46 83.67,89.46 81.64,87.43 v81.64,84.71
  Bottom 0.152: J5.17 69.95,84.07 71.27,85.4 73.86,85.4 73.92,85.33 73.93,85.33 73.99,85.26 74.09,85.16 74.18,85.07 74.26,84.98 74.31,84.94 81.13,84.94 81.35,84.71 v81.64,84.71
MK-PWM1L1  (via drill 0.25)
  Top 0.152: v83.05,85.33 83.48,85.76 83.48,87.55 84.18,88.24 86.64,88.24 86.84,88.04 U2.89
  Bottom 0.152: J5.19 69.49,86.61 70.1,86 74.14,86 74.36,85.76 74.45,85.67 74.53,85.59 74.54,85.59 74.54,85.58 74.66,85.58 82.8,85.58 v83.05,85.33
MK-PWM1L2  (via drill 0.25)
  Top 0.152: U2.87 86.47,87.04 v86.18,87.32
  Bottom 0.152: v86.18,87.32 85.56,87.32 84.8,86.57 76.31,86.57 76.3,86.56 75.03,86.56 73.3,88.29 69.32,88.29 J5.21
MK-PWM1L3  (via drill 0.25)
  Top 0.152: U2.84 88.28,85.54 87.38,84.63 85.46,84.63 85.11,84.98 85.09,84.98 84.48,85.6 v84.48,87.12 | v71.02,89.1 71.02,89.13 J5.23
  Bottom 0.152: v84.48,87.12 84.23,87.12 83.98,86.87 75.29,86.87 75.16,86.87 73.43,88.59 71.53,88.59 v71.02,89.1
MK-SPI-CS1  (via drill 0.25)
  Top 0.152: U2.83 88.59,85.04 v88.14,84.58
  Bottom 0.152: v88.14,84.58 87.45,83.9 87.45,82.79 85.79,81.13 79.48,81.13 77.71,82.91 71.12,82.91 69.75,81.53 J5.15
MK-SPI-CS2  (via drill 0.25, 0.3)
  Top 0.152: J5.13 69.62,80.16 v69.7,80.16 | U2.65 83.73,80.78 84.94,81.99 87.47,81.99 v87.55,82.07
  Bottom 0.152: v87.55,82.07 87.16,82.07 85.91,80.83 85.86,80.83 85.85,80.82 85.5,80.82 85.5,80.83 79.35,80.83 77.57,82.6 72.14,82.6 v69.7,80.16
MK-SPI-MISO
  Top 0.152: U2.45 74.96,84.02 74.07,84.02 73.43,83.39 72.01,83.39 70.81,82.19 70.81,77.27 70,76.45 J5.11
MK-SPI-MOSI
  Top 0.152: J5.12 67.23,77.78 69.95,77.78 70.51,78.33 70.51,82.32 73.23,85.04 U2.43
MK-SPI-SPCK
  Top 0.152: U2.41 73.61,86.06 70.41,82.86 65.48,82.86 64.52,81.89 64.52,75.18 65.79,73.91 J5.10
MK-TWD2
  Top 0.152: J5.9 68.73,73.91 69.7,74.88 69.7,75.59 71.17,77.06 71.17,78.33 73.2,80.37 75.13,80.37 76.15,81.38 76.15,81.99 77.98,83.82 77.98,90.12 77.56,90.54 U2.32
MK-URX3-TWCK2  (1 unrouted)
  Top 0.152: J5.7 69.04,71.37 76.73,79.06
MK-USART-CTS
  Top 0.152: J5.32 67.18,103.12 73.43,103.12 75.97,100.58 81.08,100.58 82.3,99.37 82.3,97.74 80.73,96.17 U2.17
MK-USART-RTS  (via drill 0.25)
  Top 0.152: U2.20 79.23,94.1 79.25,94.08 79.58,94.08 v79.76,93.9 | v81.74,97.97 81.74,99.49 80.95,100.28 75.85,100.28 74.32,101.8 68.5,101.8 J5.31
  Bottom 0.152: v79.76,93.9 79.76,96 v81.74,97.97
MK-USART-RX
  Top 0.152: U2.12 83.21,95.31 83.21,98.91 80.16,101.96 75.64,101.96 70.56,106.93 J5.35
MK-USART-SCK  (via drill 0.25)
  Top 0.152: J5.34 65.99,104.39 67.31,105.72 71.37,105.72 75.52,101.65 79.68,101.65 v79.93,101.4 | v89.29,100.45 89.29,96.46 89.46,96.29 89.46,95.5 v89.78,95.18 | v90.93,94.03 91.13,94.03 91.49,93.68 91.49,93.57 90.51,93.57 U2.100
  Bottom 0.152: v79.93,101.4 79.93,101.37 80.72,100.58 89.15,100.58 v89.29,100.45 | v89.78,95.18 v89.79,95.18 v90.93,94.03
MK-USART-TX
  Top 0.152: U2.11 83.72,96.32 83.52,96.52 83.52,99.03 83.34,99.21 | 83.34,99.21 | J5.36 66.55,106.93 67.72,108.1 69.92,108.1 75.75,102.27 75.77,102.26 80.29,102.26 83.34,99.21
MK-UTX3  (via drill 0.3)
  Top 0.152: U2.23 77.73,96.21 | 77.73,96.21 77.72,96.22 | 77.73,96.21 77.73,96.42 77.45,96.69 73.9,96.69 73.51,97.08 73,97.08 | v63.96,92.91 63.25,93.62 63.25,96.57 64.72,98.04 69.04,98.04 70,97.08 73,97.08 | v63.96,83.52 63.96,73.33 J5.8 | 73,97.08
  Bottom 0.152: v63.96,92.91 v63.96,83.52
N$1
  Top 0.152: D5.R 77.66,113.47 76.91,112.72 74.91,112.72 R17.2
  Top 0.203: 77.61,113.68 D5.R
N$2
  Top 0.152: D5.B 75.86,110.88 74.73,112.01 R10.2
N$3
  Top 0.152: R18.2 74.37,110.24 74.98,109.63 76.52,109.63 D5.G
N$4
  Top 0.152: U2.99 98.12,93.04 98.6,92.56 99.01,92.56 99.26,92.81 99.26,94.76 Q1.3 99.25,95.29 99.87,95.91 100.91,95.91 C13.2
  Top 0.203: 90.5,93.02 U2.99
N$5
  Top 0.152: U2.98 97.86,92.54 99.11,91.29 99.11,89.78 Q1.1 100.1,89.76 C14.1
N$7
  Top 0.203: U2.97 90.44,92.08 89.28,92.08 89.03,92.33 89.03,93.6 90.04,94.62 93.34,94.62 94.42,95.69 R6.2 C16.1
N$8
  Top 0.305: R4.2 98.3,80.24 98.3,81.53 97.98,81.86 L2.1
N$9
  Top 0.203: R5.2 90.63,101.2 L1.1
N$10
  Top 0.152: U2.90 90.5,88.52 91.69,88.52 92.13,88.08 C18.2
  Top 0.203: C18.2 93.73,87.8 93.73,87.12 94.55,87.12 94.6,87.08 95.38,87.08 96.54,85.91 L2.2
N$11
  Top 0.152: U2.9 84.7,95.31 84.7,97.28 C17.1
  Top 0.203: L1.2 85.55,97.28 84.7,97.28
N$12
  Top 0.203: D1.R 109.21,74.8 102.36,74.8 101.6,75.56 R2.2
N$13
  Top 0.203: U5.8 102.4,109.64 101.73,108.97 101.73,107.95 100.84,107.06 100.84,104.9 J3.3
N$14
  Top 0.203: J3.4 102.11,108.46 103.63,109.98 103.63,111.51 103,112.14 102.45,112.14 U5.7
N$15
  Top 0.203: U5.6 103.05,112.85 104.01,111.89 104.01,108.46 103.38,107.82 103.38,104.9 J3.5
N$16
  Top 0.203: J3.6 104.65,112.14 103.38,113.41 102.48,113.41 U5.5
N$17
  Top 0.152: D4.R 100.98,113.37 100.18,112.57 98.5,112.57 98.2,112.88 98.13,112.88 R15.2
N$18
  Top 0.152: D4.B 99.17,111.54 98.65,112.06 97.27,112.06 R9.2
N$19
  Top 0.152: R16.2 97.79,110.24 98.81,109.22 100.33,109.22 100.58,109.47 100.58,110.32 D4.G
N$20
  Top 0.203: U4.8 103.8,62.02 105.54,63.75 105.54,67.95 106.17,68.58 106.17,70.61 J2.3
N$21
  Top 0.203: U4.7 103.69,62.67 104.9,63.88 J2.4
N$22
  Top 0.203: U4.6 103.45,63.32 103.63,63.5 103.63,70.61 J2.5
N$23
  Top 0.203: U4.5 102.65,69.05 J2.6
N$24
  Top 0.203: R13.2 97.7,61.49 D3.R
N$25
  Top 0.203: U6.8 79.03,109.13 77.47,107.57 77.47,104.9 J4.3
N$26
  Top 0.203: U6.7 79.83,112.2 80.01,112.01 80.01,108.84 78.74,107.57 J4.4
N$27
  Top 0.203: U6.6 79.94,112.85 80.39,112.4 80.39,107.7 80.01,107.31 80.01,104.9 J4.5
N$28
  Top 0.203: U6.5 80.05,113.5 80.77,112.78 80.77,106.68 J4.6
N$29
  Top 0.152: D3.B 101.23,64.99 100.28,65.94 98.13,65.94 97.58,65.39
  Top 0.203: R8.2 97.58,65.39 97.72,65.53 | 101.23,64.63 D3.B
N$30
  Top 0.203: D3.G 98.44,63.5 R14.2
N$31
  Top 0.203: U3.8 79.8,62.27 81.41,63.88 81.41,67.31 82.55,68.45 82.55,70.61 J1.3
N$32
  Top 0.203: U3.7 79.81,62.92 80.52,63.63 80.52,68.58 J1.4
N$33
  Top 0.203: U3.6 79.7,63.57 79.88,63.75 79.88,68.33 80.01,68.45 80.01,70.61 J1.5
N$34
  Top 0.203: U3.5 79.03,67.53 78.74,67.82 J1.6
N$35
  Top 0.203: D2.R 75.78,61.72 R11.2
N$36
  Top 0.203: R7.2 74.36,65.79 76.71,65.79 77.61,64.88 D2.B
N$37
  Top 0.203: D2.G 74.56,63.5 R12.2
N$38
  Top 0.203: D1.B 107.35,78.23 R1.2
N$39
  Top 0.203: D1.G 107.58,76.2 R3.2
N$41  (via drill 3.2)
  other vias: 91.69,63.25
N$42  (via drill 3.2)
  other vias: 91.69,112.27
N$43  (via drill 3.2)
  other vias: 60.71,63.25
N$44  (via drill 3.2)
  other vias: 60.71,112.27
P1LB  (via drill 0.25)
  Top 0.152: R10.1 71.22,112.01 70.97,111.76 70.97,109.42 72.24,108.15 72.88,108.15 73.2,107.83 73.2,107.36 72.75,106.91 v72.75,106.63 | U2.27 74.95,93.07 73.97,93.07 73.56,93.47 73.56,94.21 73.67,94.32 v73.67,95.03
  Bottom 0.152: v72.75,106.63 72.75,106.32 73,106.07 73,98.86 73.97,97.89 73.97,95.33 v73.67,95.03
P1LG  (via drill 0.25)
  Top 0.152: U2.25 76.73,96.15 76.61,96.27 76.25,96.27 v75.79,95.81 | v73.61,108.61 72.49,108.61 71.98,109.12 71.98,110.2 R18.1
  Bottom 0.152: v75.79,95.81 75.79,96.93 73.61,99.11 v73.61,108.61
P1LR  (via drill 0.25)
  Top 0.152: U2.26 74.1,93.54 73.86,93.78 73.86,94.08 v74.27,94.49 | v72.64,107.59 72.08,107.59 70.61,109.07 70.61,113.39 71.02,113.79 R17.1
  Bottom 0.152: v72.64,107.59 73.3,106.93 73.3,98.98 74.27,98.02 v74.27,94.49
P1RX  (via drill 0.25, 0.45)
  Top 0.203: U6.2 83.47,112.14 v81.45,112.14 | U2.35 76.31,89.04 v76.33,89.05
  Bottom 0.203: v81.45,112.14 77.47,108.16 77.47,91.19 76.33,90.04 v76.33,89.05 76.33,89.03
P1TX  (via drill 0.25, 0.45)
  Top 0.203: U6.3 83.51,112.82 v82.3,112.82 | v76.91,89.76 76.91,88.81 76.57,88.47 76.09,88.47 76.02,88.54 U2.36
  Bottom 0.203: v82.3,112.82 82.14,112.66 82.14,111.86 80.01,109.73 80.01,102.49 77.83,100.31 77.83,90.58 77.01,89.76 v76.91,89.76
P2LB  (via drill 0.25)
  Top 0.152: R9.1 94.94,112.01 94.44,111.51 94.44,102.23 96.25,100.42 96.63,100.42 v97.33,99.72 | v103.17,87.17 103.17,87.02 102.67,86.51 102.67,83.97 v103.12,83.52 | U2.79 88.22,83.04 v88.19,83.01
  Bottom 0.152: v97.33,99.72 97.33,99.51 96.82,99.01 96.82,93.14 102.09,87.87 102.47,87.87 v103.17,87.17 | v103.12,83.52 103.1,83.52 102.54,82.96 102.08,82.96 101.83,83.21 95.88,83.21 92.94,80.26 91.8,80.26 89.31,82.75 88.44,82.75 v88.19,83.01
P2LG  (via drill 0.25)
  Top 0.152: R16.1 95.32,109.9 94.74,109.32 94.74,102.36 96.11,100.99 96.38,100.72 97.19,100.72 v98.14,99.77 | v103.13,88 | v103.13,88 103.73,87.4 103.73,86.81 102.97,86.06 102.97,84.46 103.68,83.75 103.68,83.28 103.35,82.96 103.33,82.96 v103.08,82.71 | v88.44,82.2 88.8,82.55 U2.78
  Bottom 0.152: v98.14,99.77 98.14,99.66 97.13,98.65 97.13,93.27 102.22,88.18 102.95,88.18 v103.13,88 | v103.08,82.71 102.72,82.71 102.67,82.65 101.95,82.65 101.7,82.91 96.01,82.91 95.35,82.25 93.06,79.96 91.67,79.96 89.18,82.45 88.69,82.45 v88.44,82.2
P2LR  (via drill 0.25)
  Top 0.152: R15.1 94.34,113.79 94.13,113.59 94.13,102.11 v96.52,99.72 | v102.36,87.17 102.36,83.57 v102.31,83.52 | U2.82 89.06,84.54 v89,84.48
  Bottom 0.152: v96.52,99.72 96.52,93.02 v102.36,87.17 | v102.31,83.52 95.76,83.52 92.81,80.57 91.95,80.57 89.46,83.06 89.46,84.02 v89,84.48
P2RX  (via drill 0.25, 0.45)
  Top 0.203: U5.2 106.84,112.14 v105.79,112.14 | U2.54 78.23,81.66 79.62,81.66 v79.76,81.79
  Bottom 0.203: v105.79,112.14 101.73,108.08 99.06,108.08 87.12,96.14 87.12,82.93 85.98,81.79 v79.76,81.79
P2TX  (via drill 0.25, 0.45)
  Top 0.203: U5.3 106.87,112.82 105.66,112.82 105.58,112.9 v105.03,112.9 | U2.46 76.68,83.54 v76.71,83.57
  Bottom 0.203: v105.03,112.9 104.14,112.01 104.14,111.25 101.32,108.43 98.91,108.43 86.77,96.29 86.77,83.08 85.83,82.14 85.81,82.17 80.39,82.17 78.99,83.57 v76.71,83.57
P3LB  (via drill 0.25)
  Top 0.152: R8.1 94.18,65.28 93.47,65.99 92.46,65.99 91.69,66.75 91.69,68.33 v91.9,68.53 | v88.6,81.28 88.6,80.92 88.75,80.77 88.75,79.81 U2.75
  Bottom 0.152: v91.9,68.53 91.9,74.57 93.47,76.15 93.47,77.67 92.41,78.74 91.14,78.74 v88.6,81.28
P3LG  (via drill 0.25)
  Top 0.152: R14.1 95.2,63.5 94.28,64.41 94.28,64.72 93.32,65.68 92.33,65.68 91.39,66.62 91.39,66.95 91.39,68.07 v91.09,68.38 | v87.78,81.08 87.27,81.08 87.22,81.03 U2.72
  Bottom 0.152: v91.09,68.38 90.43,68.38 89.76,69.04 89.76,70.05 90.53,70.81 91.24,70.81 91.59,71.17 91.59,74.7 93.16,76.26 93.16,77.56 92.28,78.44 90.42,78.44 v87.78,81.08
P3LR  (via drill 0.25)
  Top 0.152: v94.44,63.47 94.69,63.22 94.69,62.66 95.57,61.78 R13.1 | v90.83,66.09 90.83,67.18 v89.55,68.47 | v89.66,77.83 87.32,77.83 86.72,78.44 86.72,79.78 U2.71
  Bottom 0.152: v94.44,63.47 94.44,65.43 93.88,65.99 92.41,65.99 92.05,66.34 91.08,66.34 v90.83,66.09 | v89.55,68.47 89.55,68.82 89.46,68.91 89.46,70.26 90.53,71.32 91.08,71.32 91.29,71.53 91.29,76.2 v89.66,77.83
P3RX  (via drill 0.25, 0.45)
  Top 0.203: U4.2 107.1,62.61 106.05,62.61 v105.28,61.85 | U2.52 77.23,77.73 v77.22,77.72
  Bottom 0.203: v77.22,77.72 77.22,76.71 80.14,73.79 85.09,73.79 85.72,73.15 85.72,69.85 88.14,67.44 93.22,67.44 94.92,65.73 101.4,65.73 v105.28,61.85
P3TX  (via drill 0.25, 0.45)
  Top 0.203: U4.3 107.13,63.29 v106.04,63.29 | U2.55 78.73,77.74 v78.74,77.72
  Bottom 0.203: v78.74,77.72 78.74,75.69 80.26,74.17 81.51,74.17 81.53,74.14 85.24,74.14 86.08,73.3 86.08,70 88.28,67.79 93.37,67.79 95.07,66.09 102.01,66.09 104.8,63.29 v106.04,63.29
P4LB  (via drill 0.25)
  Top 0.152: R7.1 71.95,68.49 v73.97,70.51 | v74.07,80.93 74.07,81.43 74.17,81.53 U2.50
  Bottom 0.152: v73.97,70.51 73.97,80.82 v74.07,80.93
P4LG  (via drill 0.25)
  Top 0.152: R12.1 71.83,63.5 70.92,64.41 70.92,66.4 v71.02,66.5 | v73.2,68.94 73.46,68.94 74.68,70.16 74.68,72.29 74.32,72.64 74.32,74.27 75.54,75.49 80.11,75.49 81.08,76.45 81.08,78.38 80.73,78.73 U2.59
  Bottom 0.152: v71.02,66.5 71.02,66.75 v73.2,68.94
P4LR
  Top 0.152: R11.1 72.44,61.72 72.85,62.13 72.85,67.79 73.76,68.7 73.76,68.81 | 73.76,68.81 74.33,69.38 73.76,68.81 | 73.76,68.81 73.81,68.76 74.98,69.93 74.98,72.42 74.66,72.73 74.66,74.18 75.67,75.18 80.24,75.18 81.38,76.33 81.38,77.83 82.25,78.69 82.25,79.77 U2.62
P4RX  (via drill 0.25, 0.45)
  Top 0.203: U3.2 83.46,62.99 v82.04,62.99 | v73.25,80.92 73.25,81.79 73.51,82.04 U2.49
  Bottom 0.203: v82.04,62.99 82.04,64.65 82.77,65.38 82.77,65.94 82.37,66.34 81.91,66.34 80.81,67.44 76.07,67.44 73.25,70.26 v73.25,80.92
P4TX  (via drill 0.25, 0.45)
  Top 0.203: U3.3 83.47,63.63 82.55,63.63 82.09,64.09 v82.09,65.66 | v72.39,81.03 72.39,82.45 72.98,83.04 U2.47
  Bottom 0.203: v82.09,65.66 80.69,67.06 75.95,67.06 72.39,70.61 v72.39,81.03
RESET  (via drill 0.25)
  Top 0.152: 91.01,75.32 91,75.31 | TP1.10 91.89,75.32 91.01,75.32 | U2.58 80.23,78.39 v80.28,78.33 | v89,75.34 90.99,75.34 91.01,75.32
  Bottom 0.152: v80.28,78.33 80.28,77.45 82.42,75.31 88.98,75.31 v89,75.34
STLB  (via drill 0.25)
  Top 0.152: R1.1 103.58,78.23 102.67,79.15 100.28,79.15 99.6,78.47 96.41,78.47 v96.01,78.08 | v94.49,78.08 93.34,78.08 92.89,78.54 91.26,78.54 90.37,77.65 90.37,77.06 90.27,76.96 86.99,76.96 86.66,77.29 86.66,77.75 86.25,78.17 86.25,79.77 U2.70
  Bottom 0.152: v96.01,78.08 v94.49,78.08
STLR  (via drill 0.25)
  Top 0.152: R2.1 96.91,78.17 v96.01,77.27 | v94.54,77.27 93.73,77.27 92.76,78.23 91.39,78.23 90.68,77.52 90.68,76.81 90.53,76.66 86.82,76.66 86.36,77.11 86.36,77.62 85.7,78.28 85.7,79.76 U2.69
  Bottom 0.152: v96.01,77.27 v94.54,77.27
TCK  (via drill 0.25)
  Top 0.152: TP1.4 90.78,72.64 v90.04,72.64 | U2.63 82.73,78.86 82.74,78.86 v83.21,78.38
  Bottom 0.152: v83.21,78.38 88.24,78.38 89.79,76.84 89.79,72.9 v90.04,72.64
TDI
  Top 0.152: U2.74 88.23,79.03 88.77,78.49 90.37,78.49 91.39,79.5 94.03,79.5 95.15,78.38 95.15,76.04 TP1.8
TDO
  Top 0.152: U2.77 89.28,82.04 89.15,81.92 89.15,78.99 89.36,78.79 90.25,78.79 91.26,79.81 94.16,79.81 95.45,78.51 95.45,75.91 93.22,73.68 93.22,71.25 92.86,70.89 TP1.6
TMS  (via drill 0.25)
  Top 0.152: U2.57 79.73,78.1 80.01,77.82 80.01,76.94 v80.25,76.7 | v88.9,74.53 91.1,74.53 TP1.2
  Bottom 0.152: v80.25,76.7 80.61,76.7 82.3,75.01 88.42,75.01 88.75,74.68 v88.9,74.53
VDDCORE  (via drill 0.25)
  Top 0.152: U2.18 80.26,95.33 80.26,96.39 80.57,96.7 C7.2 | U2.86 90.53,86.49 91.57,86.49 | 91.57,86.49 91.77,86.28 C11.2 | U2.76 92.07,81.53 92.15,81.61 | 92.15,81.61 C10.2 | C9.2 73.09,87.04 U2.39 75.01,87.07 76.25,87.07 76.76,87.58 v77.42,87.58 | 88.65,92.15 89.31,91.49 90.43,91.49 U2.96 91.75,91.54 91.87,91.67 C12.2 | 88.65,92.15 88.65,93.75 88.85,93.96 | 88.85,93.96 | 88.85,93.96 89.15,94.26 89.15,96.16 88.9,96.42 87.43,96.42 87.23,96.22 U2.4 87.19,95.25 87.19,93.93 86.68,93.42 85.7,93.42 85.65,93.42 84.74,92.51 v84.28,92.51 | 91.57,86.49 91.57,86.94 v91.8,87.17 | U2.18 80.26,95.25 | C8.2 78.1,96.7 78.1,96.52 78.23,96.39 U2.22 78.23,93.43 79.15,92.51 v80.26,92.51 80.26,93.61 80.41,93.76 80.41,94.26 80.23,94.45 U2.18 | 88.65,92.15 v87.88,92.15 | 92.15,81.61 92.15,81.78 v91.85,82.09
  Bottom 0.152: v84.28,92.51 v80.26,92.51 80.26,90.42 v77.42,87.58 | v87.88,92.15 87.45,91.72 87.45,89.03 89.31,87.17 v91.8,87.17 91.85,87.12 v91.85,82.09

### Text on the board
tPlace: TP1 | TP2 | mkswitch v0.2 | TP4 | TP3
bPlace: the best material model of a cat / is another, or preferably the same / cat